# Altium schematic sheet MCU.SchDoc
size A4; SheetNumber: 2; SheetTotal: 6
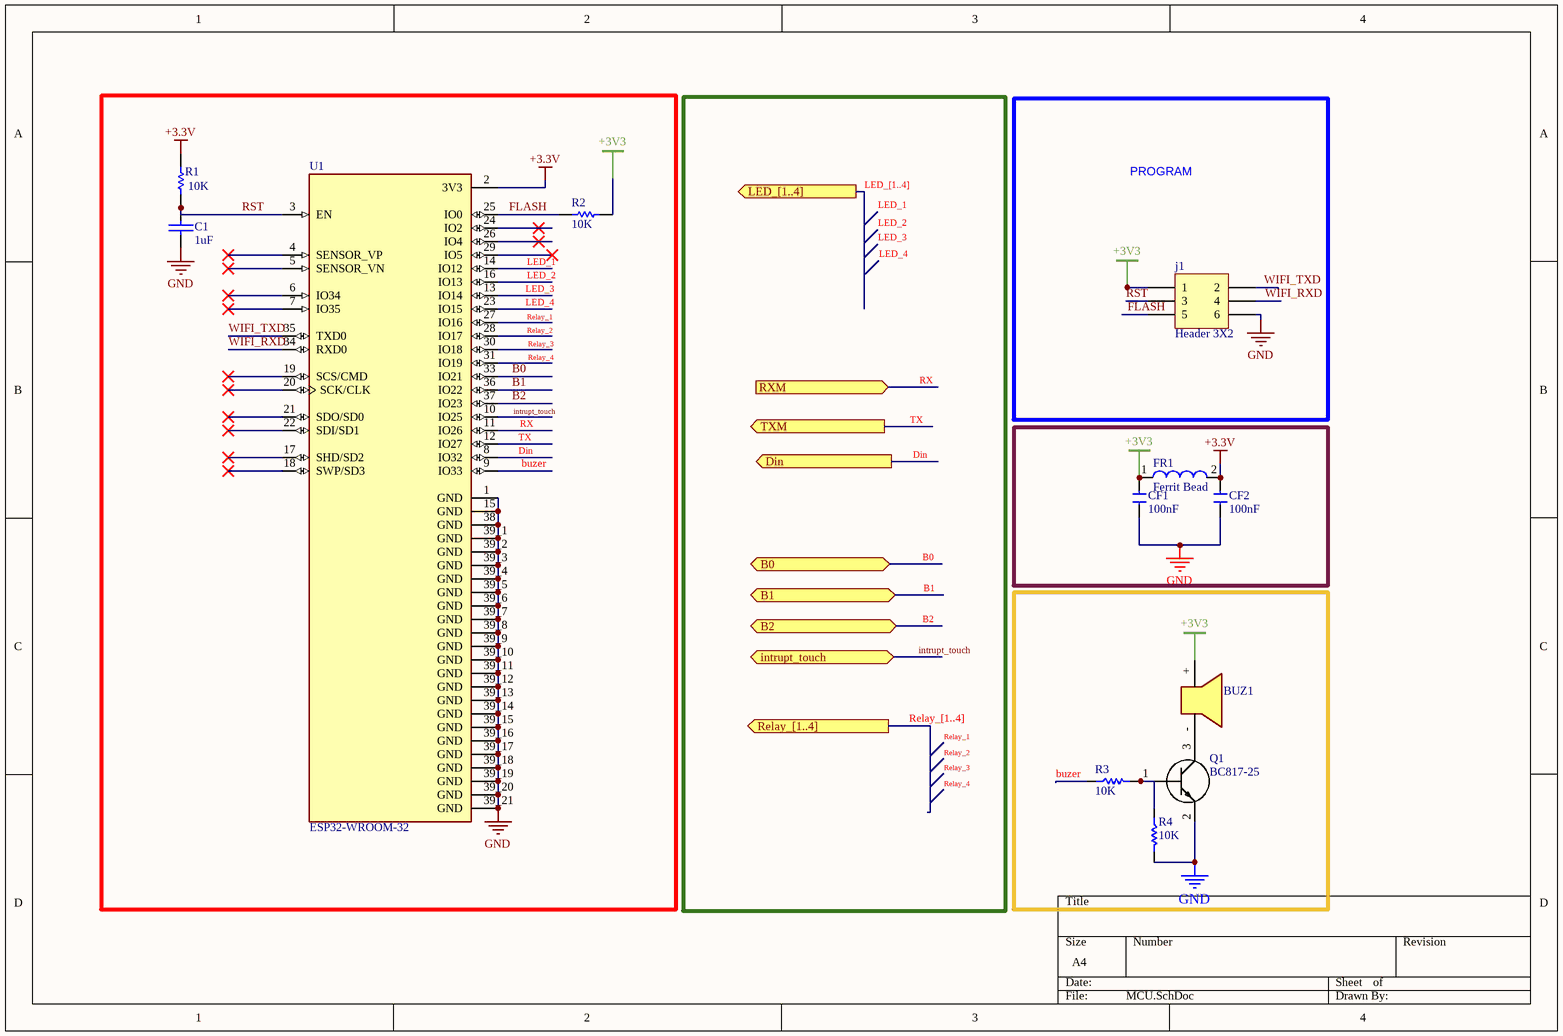
[diagram p0: MCU.SchDoc]

## Parts
BUZ1  Buzzer  [Buzzer_japan]  (value not drawn)
C1  1uF  [RES 0603 (1608X06L)]
CF1  Capacitor SMD  [RES 0603 (1608X06L)]  (value not drawn)
CF2  Capacitor SMD  [RES 0603 (1608X06L)]  (value not drawn)
FR1  Ferrit Bead  [RES 0805 (2012X06L)]
j1  Header 3X2  [HDR2X3]
Q1  BC817-25  [BC81725215]
R1  10K  [RES 0603 (1608X06L)]
R2  10K  [RES 0603 (1608X06L)]
R3  10K  [RES 0603 (1608X06L)]
R4  10K  [RES 0603 (1608X06L)]
U1  ESP32-WROOM-32  [MODULE_ESP32-WROOM-32]

## Blocks framed on the sheet
PROGRAM: j1

## Ports
B0 (bidir), B1 (bidir), B2 (bidir), Din (out), intrupt_touch (bidir), LED_[1..4] (out), Relay_[1..4] (out), RXM (in), TXM (out)

## Nets
+3.3V: CF2.1 FR1.2 R1.2 U1.2(3V3)
+3V3: BUZ1.+ CF1.1 FR1.1 j1.1 R2.1
GND: C1.1 CF1.2 CF2.2 j1.6 Q1.2(E) R4.2 U1.1(GND) U1.15(GND) U1.38(GND) U1.39_1(GND) U1.39_2(GND) U1.39_3(GND) U1.39_4(GND) U1.39_5(GND) U1.39_6(GND) U1.39_7(GND) U1.39_8(GND) U1.39_9(GND) U1.39_10(GND) U1.39_11(GND) U1.39_12(GND) U1.39_13(GND) U1.39_14(GND) U1.39_15(GND) U1.39_16(GND) U1.39_17(GND) U1.39_18(GND) U1.39_19(GND) U1.39_20(GND) U1.39_21(GND)
B0: U1.33(IO21) ; port B0
B1: U1.36(IO22) ; port B1
B2: U1.37(IO23) ; port B2
buzer: R3.1 U1.9(IO33)
Din: U1.8(IO32) ; port Din
FLASH: j1.5 R2.2 U1.25(IO0)
intrupt_touch: U1.10(IO25) ; port intrupt_touch
LED_1: U1.14(IO12)
LED_2: U1.16(IO13)
LED_3: U1.13(IO14)
LED_4: U1.23(IO15)
Relay_1: U1.27(IO16)
Relay_2: U1.28(IO17)
Relay_3: U1.30(IO18)
Relay_4: U1.31(IO19)
RST: C1.2 j1.3 R1.1 U1.3(EN)
RX: U1.11(IO26) ; port RXM
TX: U1.12(IO27) ; port TXM
WIFI_RXD: j1.4 U1.34(RXD0)
WIFI_TXD: j1.2 U1.35(TXD0)
NetBUZ1_-: BUZ1.- Q1.3(C)
NetQ1_1: Q1.1(B) R3.2 R4.1

Not connected (* = marked no-connect by the designer): U1 4(SENSOR_VP)* 5(SENSOR_VN)* 6(IO34)* 7(IO35)* 17(SHD/SD2)* 18(SWP/SD3)* 19(SCS/CMD)* 20(SCK/CLK)* 21(SDO/SD0)* 22(SDI/SD1)* 24(IO2)* 26(IO4)* 29(IO5)*

## Buses and harness runs
bus LED_[1..4] = port LED_[1..4]
bus Relay_[1..4] = port Relay_[1..4]

## Notes on the sheet
- Labels drawn without touching a wire or pin: LED_1, LED_2, LED_3, LED_4, Relay_1, Relay_2, Relay_3, Relay_4
- (in symbol Capacitor SMD) 100nF

## Library data of the parts
BUZ1 = Buzzer..: Buzzer/dip/12v; pin to pad: +>1 ->2; LatestRevisionDate: 17-Jul-2002; LatestRevisionNote: Re-released for DXP Platform.; Publisher: Altium Limited
C1 = CAP: Capacitor; Value: 1uF
j1 = Header 3X2: Header, 3-Pin, Dual row; LatestRevisionDate: 17-Jul-2002; LatestRevisionNote: Re-released for DXP Platform.; Publisher: Altium Limited
Q1 = BC817-25: Transistor BJT NPN; Manufacturer_Name: Nexperia; Datasheet Link: https://assets.nexperia.com/documents/data-sheet/BC817_BC817W_BC337.pdf; Height: 1.1mm; Manufacturer_Part_Number: BC817-25; Mouser Part Number: N/A; Mouser Price/Stock: https://www.mouser.com/Search/Refine.aspx?Keyword=N%2FA
R1 R2 = Res1: Resistor; Published: 8-Jun-2000; LatestRevisionDate: 17-Jul-2002; LatestRevisionNote: Re-released for DXP Platform.; PackageReference: AXIAL-0.3; Publisher: Altium Limited; Value: 10K
R3 R4 = Resistor: Tolerance: 5%; Power: 1/8 W; Value: 10K
U1 = ESP32-WROOM-32: Bluetooth, WiFi Transceiver Module 2.4GHz ~ 2.5GHz Surface Mount; MF: Espressif Systems; Package: Module Espressif Systems; Digi-Key_Part_Number: 1904-1010-1-ND; Digi-Key_Purchase_URL: https://www.digikey.com/product-detail/en/espressif-systems/ESP32-WROOM-32/1904-1010-1-ND/8544305?utm_source=snapeda&utm_medium=aggregator&utm_campaign=symbol; Value: *; MP: ESP32-WROOM-32; SnapEDA_Link: https://www.snapeda.com/parts/ESP32-WROOM-32/Espressif%20Systems/view-part/2753322/?ref=snap